# Altium schematic sheet APC1_EPS.SchDoc: =GlobalProjectName
size A4; ApprovedBy: Утвердил; CheckedBy: Проверил; Author: Разработал; SheetNumber: 1; SheetTotal: 7; PageSetup: Record=PageOptions|CenterHorizontal=True|CenterVertical=True|PrintScale=1.00|XCorrection=1.00|YCorrection=1.00|PrintKind=1|BorderSize=5000000|LeftOffset=0|BottomOffset=0|Orientation=2|PaperLength=1000|PaperWidth=1000|Scale=100|PaperSource=15|PrintQuality=1200|MediaType=1|DitherType=10|PaperKind=A3|PrintScaleMode=1; Weight: -; ScaleFactor: -; NormInspection: Норм.Контр.
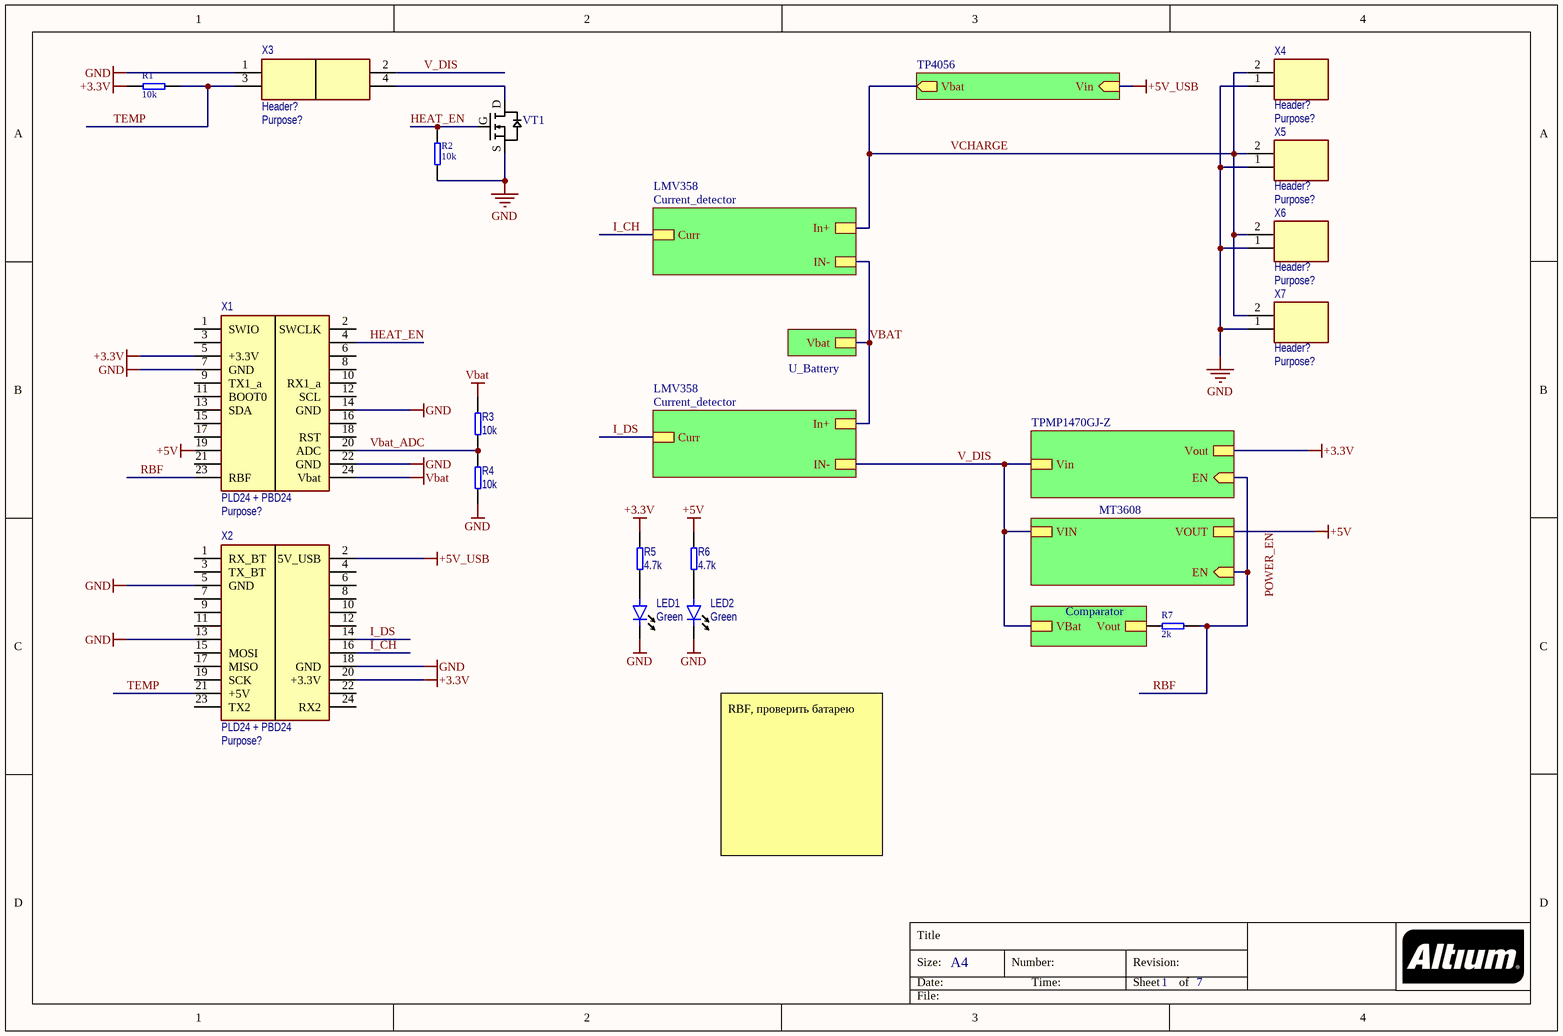
[diagram p0: APC1_EPS.SchDoc]

## Parts
LED1  value Green  [LED 0603]
LED2  value Green  [LED 0603]
R1  value 10k  [RES 0402]
R2  value 10k  [RES 0402]
R3  value 10k  [RES 0402]
R4  value 10k  [RES 0402]
R5  value 4.7k  [RES 0402]
R6  value 4.7k  [RES 0402]
R7  value 2k  [RES 0402]
VT1  AO3400A  [SOT23-3]  (value not drawn)
X1  PLD24 + PBD24  Purpose: Purpose?  [PICOSAT_CNN]
X2  PLD24 + PBD24  Purpose: Purpose?  [PICOSAT_CNN]
X3  Header?  Purpose: Purpose?  [PBD-4-2.54]
X4  Header?  Purpose: Purpose?  [ZH-2]
X5  Header?  Purpose: Purpose?  [ZH-2]
X6  Header?  Purpose: Purpose?  [ZH-2]
X7  Header?  Purpose: Purpose?  [ZH-2]

## Sub-sheets
Comparator = Comparator.SchDoc: VBat, Vout
LMV358 = Current_detector: In+, IN-, Curr
LMV358 = Current_detector: In+, IN-, Curr
MT3608 = MT3608.SchDoc: VIN, VOUT, EN (in)
TP4056 = TP4056.SchDoc: Vin (in), Vbat (out)
TPMP1470GJ-Z = TPMP1470GJ-Z.SchDoc: Vin, Vout, EN (in)
U_Battery = Battery.SchDoc: Vbat

## Nets
+3.3V: R1.1 R5.2 X1.5(+3.3V) X2.20(+3.3V) ; sheet TPMP1470GJ-Z/Vout
+5V_USB: X2.2(5V_USB) ; sheet TP4056/Vin
GND: LED1.2(Cathode) LED2.2(Cathode) R2.1 R4.1 VT1.S1 X1.7(GND) X1.14(GND) X1.22(GND) X2.5(GND) X2.13 X2.18(GND) X3.1 X4.1 X5.1 X6.1 X7.1
POWER_EN: R6.2 X1.19 ; sheet MT3608/VOUT  [also labelled +5V]
VBAT: R3.2 X1.24(Vbat) ; sheet U_Battery/Vbat, sheet LMV358/In+, sheet LMV358/IN-
HEAT_EN: R2.2 VT1.G2 X1.4
I_CH: X2.16 ; sheet LMV358/Curr
I_DS: X2.14 ; sheet LMV358/Curr
RBF: R7.2 X1.23(RBF) ; sheet TPMP1470GJ-Z/EN, sheet MT3608/EN
TEMP: R1.2 X2.21(+5V) X3.3
V_DIS: X3.2 ; sheet TPMP1470GJ-Z/Vin, sheet Comparator/VBat, sheet LMV358/IN-, sheet MT3608/VIN
Vbat_ADC: R3.1 R4.2 X1.20(ADC)
VCHARGE: X4.2 X5.2 X6.2 X7.2 ; sheet TP4056/Vbat, sheet LMV358/In+
NetLED1_1: LED1.1(Anode) R5.1
NetLED2_1: LED2.1(Anode) R6.1
NetR7_1: R7.1 ; sheet Comparator/Vout
NetVT1_D6: VT1.D6 X3.4

Not connected (* = marked no-connect by the designer): X1 1(SWIO) 2(SWCLK) 3 6 8 9(TX1_a) 10(RX1_a) 11(BOOT0) 12(SCL) 13(SDA) 15 16 17 18(RST) 21; X2 1(RX_BT) 3(TX_BT) 4 6 7 8 9 10 11 12 15(MOSI) 17(MISO) 19(SCK) 22 23(TX2) 24(RX2)

## Notes on the sheet
- RBF, проверить батарею
- Title
- Size:
- Date:
- A4
- Number:
- Time:
- Revision:
- Sheet
- of
- File:
- (in symbol !Generic N MOSFET) D; G; S

## Library data of the parts
LED1 LED2 = LED: Light Emittering Diode; IsSMT: NoSMT
R1-R7 = !Resistor: Resistor; IsSMT: NoSMT
VT1 = !Generic N MOSFET: generic N mosfet; pin to pad: D6>3 G2>1 S1>2; IsSMT: NoSMT
X1 X2 = Header 2x12: 10x2 header; IsSMT: NoSMT
X3 = Header 2x2: 2x2 header; IsSMT: NoSMT
X4-X7 = Header 1x2: 2x1 header; isSMT: NoSMT